# EAGLE schematic untitled_4 (EAGLE 9.2.2)
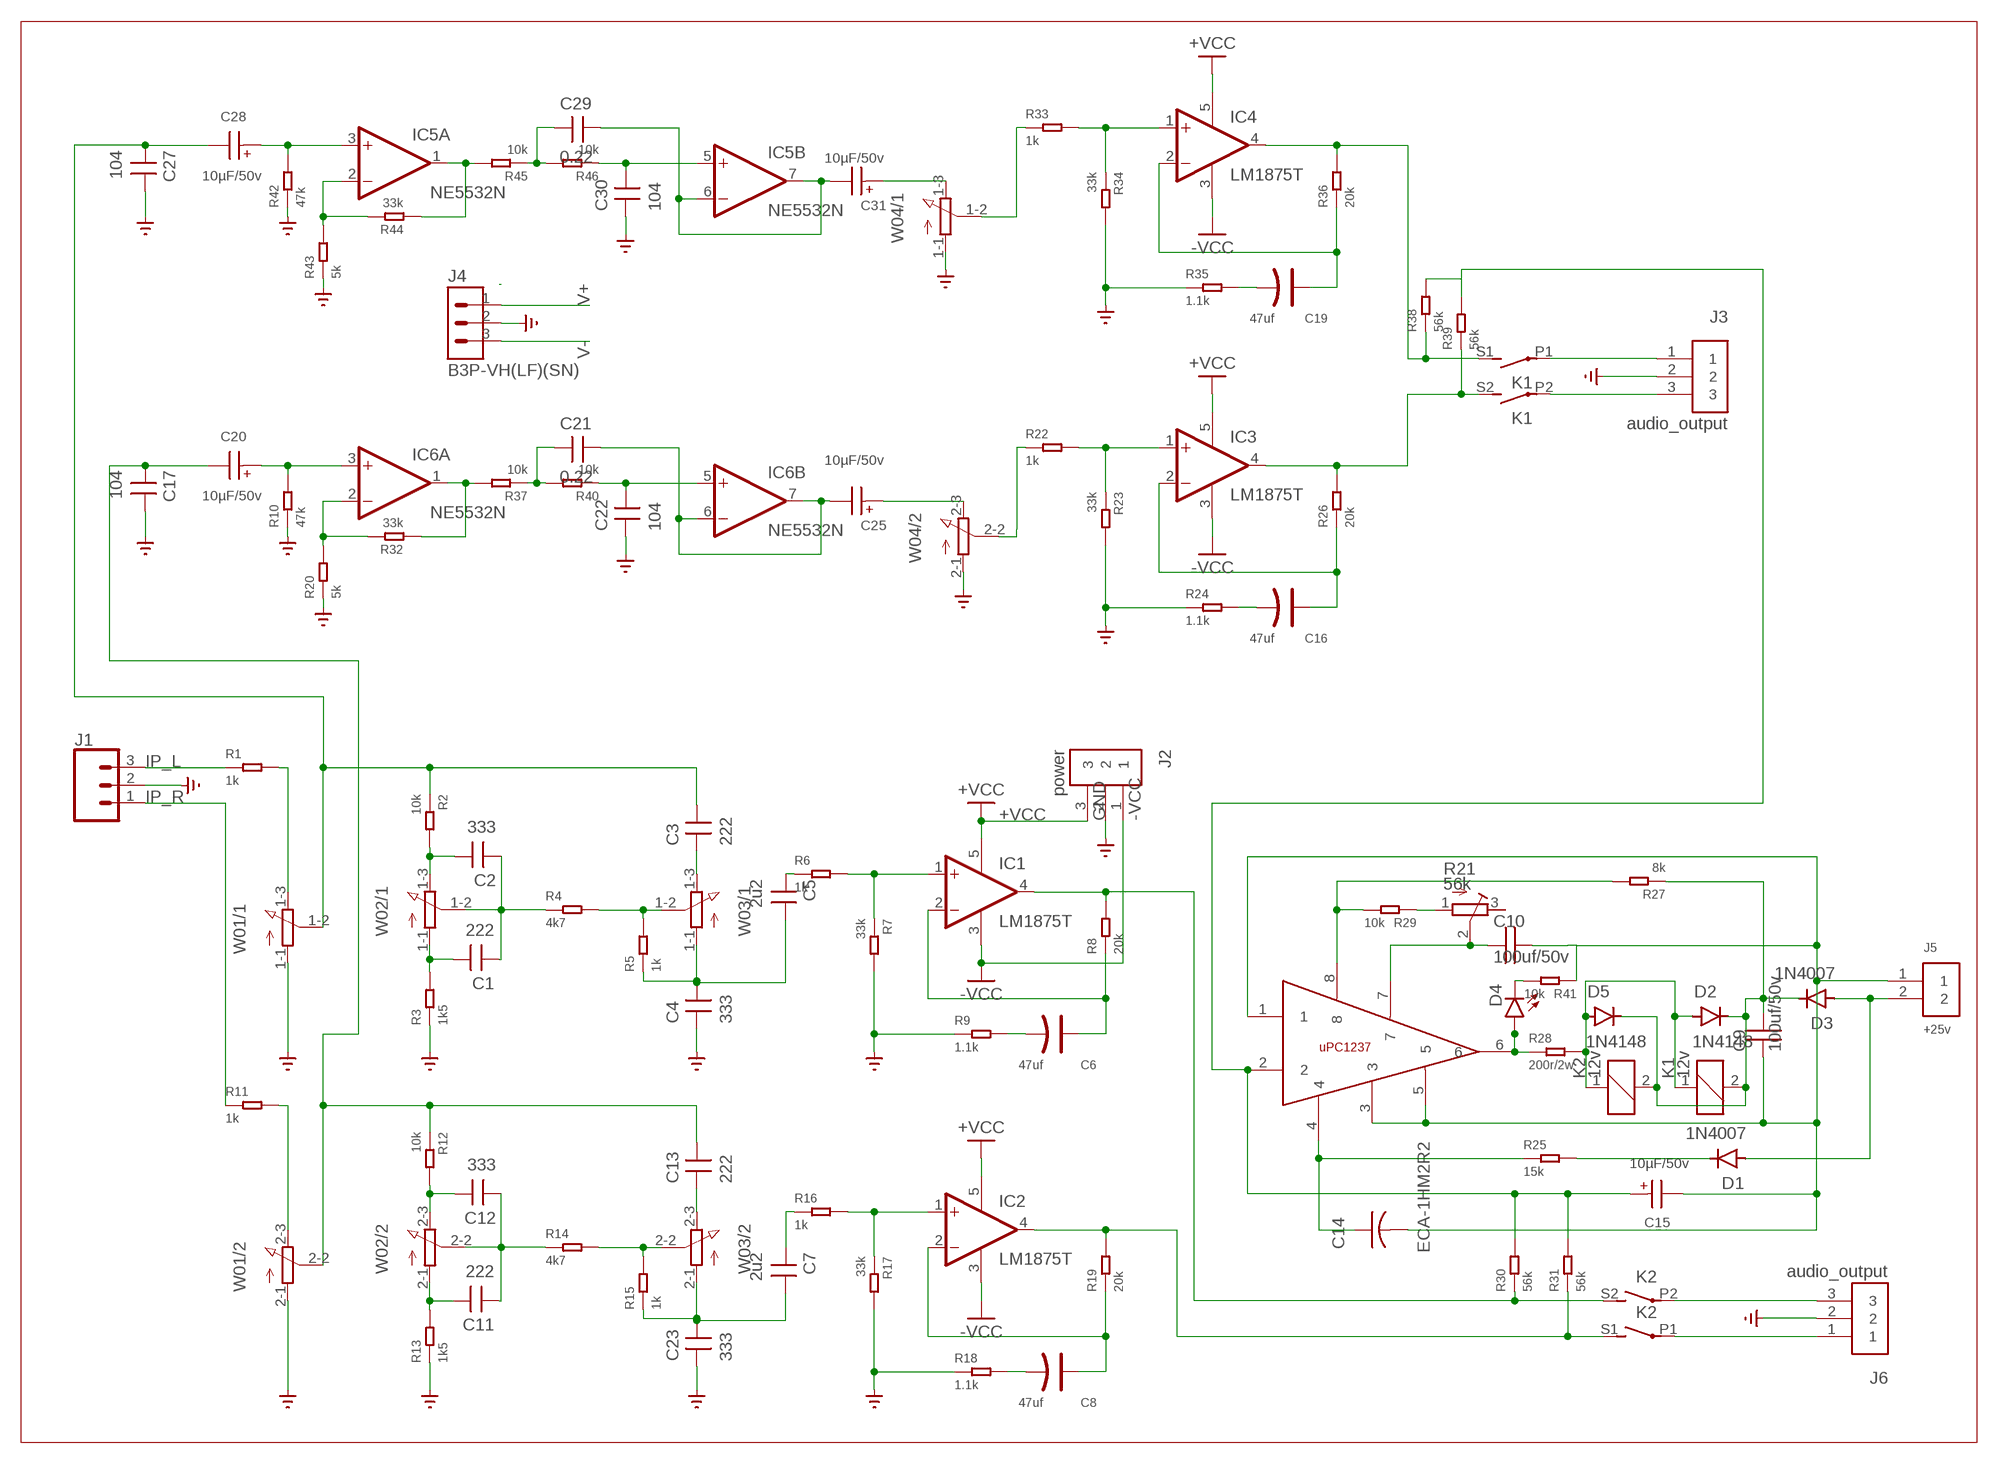
[diagram p0: schematic, sheet 1]

## Parts
C1  222  5.08MM-  [5.08MM-独石电容]
C2  333  5.08MM-  [5.08MM-独石电容]
C3  222  5.08MM-  [5.08MM-独石电容]
C4  333  5.08MM-  [5.08MM-独石电容]
C5  2u2  5.08MM-  [5.08MM-独石电容]
C6  47uf  DIP-ALUMINUM-47UF-16V(D5-H7MM)  [PC-D5.3MM]
C7  2u2  5.08MM-  [5.08MM-独石电容]
C8  47uf  DIP-ALUMINUM-47UF-16V(D5-H7MM)  [PC-D5.3MM]
C9  100uf/50v  50V100UF8X12  [8X12]
C10  100uf/50v  50V100UF8X12  [8X12]
C11  222  5.08MM-  [5.08MM-独石电容]
C12  333  5.08MM-  [5.08MM-独石电容]
C13  222  5.08MM-  [5.08MM-独石电容]
C14  ECA-1HM2R2  [CAP_RADIAL_2MM]
C15  10µF/50v  WCAP-AT1H_5X11_860240272001  [WCAP-AT1H_5X11(DXL)]
C16  47uf  DIP-ALUMINUM-47UF-16V(D5-H7MM)  [PC-D5.3MM]
C17  104  5.08MM-  [5.08MM-独石电容]
C19  47uf  DIP-ALUMINUM-47UF-16V(D5-H7MM)  [PC-D5.3MM]
C20  10µF/50v  WCAP-AT1H_5X11_860240272001  [WCAP-AT1H_5X11(DXL)]
C21  0.22  5.08MM-  [5.08MM-独石电容]
C22  104  5.08MM-  [5.08MM-独石电容]
C23  333  5.08MM-  [5.08MM-独石电容]
C25  10µF/50v  WCAP-AT1H_5X11_860240272001  [WCAP-AT1H_5X11(DXL)]
C27  104  5.08MM-  [5.08MM-独石电容]
C28  10µF/50v  WCAP-AT1H_5X11_860240272001  [WCAP-AT1H_5X11(DXL)]
C29  0.22  5.08MM-  [5.08MM-独石电容]
C30  104  5.08MM-  [5.08MM-独石电容]
C31  10µF/50v  WCAP-AT1H_5X11_860240272001  [WCAP-AT1H_5X11(DXL)]
D1  1N4007  [DO-41]
D2  1N4148  1N4007  [DO-41]
D3  1N4007  [DO-41]
D4  BEAGLEBONE_BLUE_LED-3MM-NO_SILK  [BEAGLEBONE_BLUE_BEAGLEBONE_BLUE_LED3MM-NS]
D5  1N4148  1N4007  [DO-41]
IC1  LM1875T  [CB367]
IC2  LM1875T  [CB367]
IC3  LM1875T  [CB367]
IC4  LM1875T  [CB367]
IC5  NE5532N  [DIL08]
IC6  NE5532N  [DIL08]
J1  CONN_03POLAR  [MOLEX-1X3]
J2  power  691311400103  [TERMINALBLOCK_PLUGGABLE-3-7.62MM]
J3  audio_output  691311400103  [TERMINALBLOCK_PLUGGABLE-3-7.62MM]
J4  B3P-VH(LF)(SN)  [HDR-03]
J5  +25v  S2B-PH-K-S(LF)(SN)  [S2B-PH-K-S(LF)(SN)]
J6  audio_output  691311400103  [TERMINALBLOCK_PLUGGABLE-3-7.62MM]
K1  12v  G2R2A  [G2R2A]
K2  12v  G2R2A  [G2R2A]
R1  1k  DIP-RES-1M-5%-1/4W(PR-D2.3XL6.5MM)  [PR-D2.3XL6.5MM]
R2  10k  DIP-RES-1M-5%-1/4W(PR-D2.3XL6.5MM)  [PR-D2.3XL6.5MM]
R3  1k5  DIP-RES-1M-5%-1/4W(PR-D2.3XL6.5MM)  [PR-D2.3XL6.5MM]
R4  4k7  DIP-RES-1M-5%-1/4W(PR-D2.3XL6.5MM)  [PR-D2.3XL6.5MM]
R5  1k  DIP-RES-1M-5%-1/4W(PR-D2.3XL6.5MM)  [PR-D2.3XL6.5MM]
R6  1k  DIP-RES-1M-5%-1/4W(PR-D2.3XL6.5MM)  [PR-D2.3XL6.5MM]
R7  33k  DIP-RES-1M-5%-1/4W(PR-D2.3XL6.5MM)  [PR-D2.3XL6.5MM]
R8  20k  DIP-RES-1M-5%-1/4W(PR-D2.3XL6.5MM)  [PR-D2.3XL6.5MM]
R9  1.1k  DIP-RES-1M-5%-1/4W(PR-D2.3XL6.5MM)  [PR-D2.3XL6.5MM]
R10  47k  DIP-RES-1M-5%-1/4W(PR-D2.3XL6.5MM)  [PR-D2.3XL6.5MM]
R11  1k  DIP-RES-1M-5%-1/4W(PR-D2.3XL6.5MM)  [PR-D2.3XL6.5MM]
R12  10k  DIP-RES-1M-5%-1/4W(PR-D2.3XL6.5MM)  [PR-D2.3XL6.5MM]
R13  1k5  DIP-RES-1M-5%-1/4W(PR-D2.3XL6.5MM)  [PR-D2.3XL6.5MM]
R14  4k7  DIP-RES-1M-5%-1/4W(PR-D2.3XL6.5MM)  [PR-D2.3XL6.5MM]
R15  1k  DIP-RES-1M-5%-1/4W(PR-D2.3XL6.5MM)  [PR-D2.3XL6.5MM]
R16  1k  DIP-RES-1M-5%-1/4W(PR-D2.3XL6.5MM)  [PR-D2.3XL6.5MM]
R17  33k  DIP-RES-1M-5%-1/4W(PR-D2.3XL6.5MM)  [PR-D2.3XL6.5MM]
R18  1.1k  DIP-RES-1M-5%-1/4W(PR-D2.3XL6.5MM)  [PR-D2.3XL6.5MM]
R19  20k  DIP-RES-1M-5%-1/4W(PR-D2.3XL6.5MM)  [PR-D2.3XL6.5MM]
R20  5k  DIP-RES-1M-5%-1/4W(PR-D2.3XL6.5MM)  [PR-D2.3XL6.5MM]
R21  56k  R-TRIMM3296W  [RTRIM3296W]
R22  1k  DIP-RES-1M-5%-1/4W(PR-D2.3XL6.5MM)  [PR-D2.3XL6.5MM]
R23  33k  DIP-RES-1M-5%-1/4W(PR-D2.3XL6.5MM)  [PR-D2.3XL6.5MM]
R24  1.1k  DIP-RES-1M-5%-1/4W(PR-D2.3XL6.5MM)  [PR-D2.3XL6.5MM]
R25  15k  DIP-RES-1M-5%-1/4W(PR-D2.3XL6.5MM)  [PR-D2.3XL6.5MM]
R26  20k  DIP-RES-1M-5%-1/4W(PR-D2.3XL6.5MM)  [PR-D2.3XL6.5MM]
R27  8k  DIP-RES-1M-5%-1/4W(PR-D2.3XL6.5MM)  [PR-D2.3XL6.5MM]
R28  200r/2w  DIP-RES-1M-5%-1/4W(PR-D2.3XL6.5MM)  [PR-D2.3XL6.5MM]
R29  10k  DIP-RES-1M-5%-1/4W(PR-D2.3XL6.5MM)  [PR-D2.3XL6.5MM]
R30  56k  DIP-RES-1M-5%-1/4W(PR-D2.3XL6.5MM)  [PR-D2.3XL6.5MM]
R31  56k  DIP-RES-1M-5%-1/4W(PR-D2.3XL6.5MM)  [PR-D2.3XL6.5MM]
R32  33k  DIP-RES-1M-5%-1/4W(PR-D2.3XL6.5MM)  [PR-D2.3XL6.5MM]
R33  1k  DIP-RES-1M-5%-1/4W(PR-D2.3XL6.5MM)  [PR-D2.3XL6.5MM]
R34  33k  DIP-RES-1M-5%-1/4W(PR-D2.3XL6.5MM)  [PR-D2.3XL6.5MM]
R35  1.1k  DIP-RES-1M-5%-1/4W(PR-D2.3XL6.5MM)  [PR-D2.3XL6.5MM]
R36  20k  DIP-RES-1M-5%-1/4W(PR-D2.3XL6.5MM)  [PR-D2.3XL6.5MM]
R37  10k  DIP-RES-1M-5%-1/4W(PR-D2.3XL6.5MM)  [PR-D2.3XL6.5MM]
R38  56k  DIP-RES-1M-5%-1/4W(PR-D2.3XL6.5MM)  [PR-D2.3XL6.5MM]
R39  56k  DIP-RES-1M-5%-1/4W(PR-D2.3XL6.5MM)  [PR-D2.3XL6.5MM]
R40  10k  DIP-RES-1M-5%-1/4W(PR-D2.3XL6.5MM)  [PR-D2.3XL6.5MM]
R41  10k  DIP-RES-1M-5%-1/4W(PR-D2.3XL6.5MM)  [PR-D2.3XL6.5MM]
R42  47k  DIP-RES-1M-5%-1/4W(PR-D2.3XL6.5MM)  [PR-D2.3XL6.5MM]
R43  5k  DIP-RES-1M-5%-1/4W(PR-D2.3XL6.5MM)  [PR-D2.3XL6.5MM]
R44  33k  DIP-RES-1M-5%-1/4W(PR-D2.3XL6.5MM)  [PR-D2.3XL6.5MM]
R45  10k  DIP-RES-1M-5%-1/4W(PR-D2.3XL6.5MM)  [PR-D2.3XL6.5MM]
R46  10k  DIP-RES-1M-5%-1/4W(PR-D2.3XL6.5MM)  [PR-D2.3XL6.5MM]
U2  UPC1237HA  [SIP8]
W01  3RP/1610G  [3RP/1610G]
W02  3RP/1610G  [3RP/1610G]
W03  3RP/1610G  [3RP/1610G]
W04  3RP/1610G  [3RP/1610G]

## Nets
+VCC: IC1.5(V+) IC2.5(V+) IC3.5(V+) IC4.5(V+) J2.3
-VCC: IC1.3(V-) IC2.3(V-) IC3.3(V-) IC4.3(V-) J2.1
GND: C4.P$2 C17.P$1 C22.P$2 C23.P$2 C27.P$1 C30.P$2 J1.2 J2.2 J3.2 J4.2 J6.2 R3.1 R7.2 R9.1 R10.1 R13.1 R17.2 R18.1 R20.1 R23.2 R24.1 R34.2 R35.1 R42.1 R43.1 W01.1-1(/1:A) W01.2-1(/2:A) W04.1-1(/1:A) W04.2-1(/2:A) ; supply symbol labelled SUPPLY0_GND_
IP_L: J1.3 R1.1
IP_R: J1.1 R11.1
N$1: R1.2 W01.1-3(/1:E)
N$2: D4.K(C) R41.2
N$3: C2.P$1 R2.2 W02.1-3(/1:E)
N$4: C1.P$1 R3.2 W02.1-1(/1:A)
N$5: R4.2 R5.2 W03.1-2(/1:S)
N$6: C1.P$2 C2.P$2 R4.1 W02.1-2(/1:S)
N$7: IC1.1(+IN) R6.2 R7.1
N$8: C4.P$1 C5.P$1 R5.1 W03.1-1(/1:A)
N$9: IC1.4(OUT) K2.S2(3:S) R8.2 R30.1
N$10: C6.+ IC1.2(-IN) R8.1
N$11: C5.P$2 R6.1
N$12: C6.- R9.2
N$14: C3.P$2 W03.1-3(/1:E)
N$15: R11.2 W01.2-3(/2:E)
N$16: C3.P$1 C27.P$2 C28.2(-) R2.1 W01.1-2(/1:S)
N$17: C12.P$1 R12.2 W02.2-3(/2:E)
N$18: C11.P$1 R13.2 W02.2-1(/2:A)
N$19: R14.2 R15.2 W03.2-2(/2:S)
N$20: C11.P$2 C12.P$2 R14.1 W02.2-2(/2:S)
N$21: C7.P$1 C23.P$1 R15.1 W03.2-1(/2:A)
N$22: IC2.1(+IN) R16.2 R17.1
N$23: IC2.4(OUT) K2.S1(2:S) R19.2 R31.1
N$24: C8.+ IC2.2(-IN) R19.1
N$25: C7.P$2 R16.1
N$26: C8.- R18.2
N$27: C20.1(+) IC6.3(A:+IN) R10.2
N$28: C13.P$2 W03.2-3(/2:E)
N$29: J6.1 K2.P1(2:P)
N$30: J6.3 K2.P2(3:P)
N$31: D1.C R25.2
N$32: C10.1 R21.2(S) U2.7
N$33: R33.1 W04.1-2(/1:S)
N$34: IC3.1(+IN) R22.2 R23.1
N$35: IC3.4(OUT) K1.S2(3:S) R26.2 R39.1
N$36: C16.+ IC3.2(-IN) R26.1
N$37: R22.1 W04.2-2(/2:S)
N$38: C16.- R24.2
N$39: IC6.2(A:-IN) R20.2 R32.2
N$40: D1.A D3.A J5.2
N$41: D4.A R28.1 U2.6
N$42: D2.A D5.A K1.1 K2.1 R28.2
N$43: C9.2 D2.C D3.C D5.C K1.2 K2.2 R27.1
N$44: R27.2 R29.2 U2.8
N$45: R21.1(A) R29.1
N$46: J3.3 K1.P2(3:P)
N$47: C14.1 R25.1 U2.4
N$48: C15.1(+) R30.2 R31.2 R38.2 R39.2 U2.2
N$49: C28.1(+) IC5.3(A:+IN) R42.2
N$50: IC4.1(+IN) R33.2 R34.1
N$51: IC4.4(OUT) K1.S1(2:S) R36.2 R38.1
N$52: C19.+ IC4.2(-IN) R36.1
N$54: C19.- R35.2
N$55: IC6.1(A:OUT) R32.1 R37.2
N$56: C9.1 C10.2 C14.2 C15.2(-) J5.1 R41.1 U2.1 U2.3 U2.5
N$57: J3.1 K1.P1(2:P)
N$58: C13.P$1 C17.P$2 C20.2(-) R12.1 W01.2-2(/2:S)
N$59: C21.P$2 R37.1 R40.2
N$60: C22.P$1 IC6.5(B:+IN) R40.1
N$61: C21.P$1 C25.2(-) IC6.6(B:-IN) IC6.7(B:OUT)
N$62: C29.P$1 C31.2(-) IC5.6(B:-IN) IC5.7(B:OUT)
N$63: IC5.2(A:-IN) R43.2 R44.2
N$64: IC5.1(A:OUT) R44.1 R45.2
N$65: C29.P$2 R45.1 R46.2
N$66: C30.P$1 IC5.5(B:+IN) R46.1
N$68: C31.1(+) W04.1-3(/1:E)
N$69: C25.1(+) W04.2-3(/2:E)
V+: J4.1
V-: J4.3
Unconnected: R21.3(E)

## Power pins joined to a net without a drawn wire
V+: IC5.8(P:V+) IC6.8(P:V+)
V-: IC5.4(P:V-) IC6.4(P:V-)

## Library data of the parts
C1-C5 C7 C11-C13 C17 C21-C23 C27 C29 C30 = Audio-Power-amlifier:5.08MM-; LONG: 5.08mm
C6 C8 C16 C19 = OPL_Capacitor:DIP-ALUMINUM-47UF-16V(D5-H7MM): 302030033; MPN: KS 100uF/16V; VALUE: 100uf
C9 C10 = Audio-Power-amlifier:50V100UF8X12
C14 = Resistor_Capacitor:ECA-1HM2R2: CAP ALUM 2.2UF 20% 50V RADIAL Manufacturer's datasheet <https://media.digikey.com/pdf/Data%20Sheets/Panasonic%20Electronic%20Components/ECA-xxM%20Series,TypeA.pdf>; CREATED_BY: PCBLayout.com; DIGIKEY_PART_NUMBER: P5175-ND; MANUFACTURER: Panasonic Electronic Components; MPN: ECA-1HM2R2; PACKAGE: CAP RADIAL 2MM LS
C15 C20 C25 C28 C31 = Wurth_Capacitors_WCAP-AT1H:WCAP-AT1H_5X11: WCAP-AT1H Aluminium Electrolytic Capacitors Long Life +105 °C Characteristics Long life product series Mounting style: THT Radial Capacitance range: 6.8 µF ‒ 3300 µF Capacitance tolerance: ±20 % Voltage range (UR): 10 ‒ 450 V(DC) Operating temperature: -40 °C up to +105 °C for UR ≤100 V(DC) -25 °C up to +105 °C for UR > 100 V(DC) Endurance: 5000 ‒ 10000 h @ +105 °C Dimensions (DxL) in mm: 5.0 x 11.0 up to 18.0 x 35.5 Recommended soldering: Wave soldering Applications Long life applications (industry, medical) Filtering Smoothing Energy storage Coupling e.g. Switched-mode power supply, AC/DC converter, adapter, charger, digital camera <https://www.we-online.com/catalog/media/o14727v209%20Family_WCAP-AT1H.jpg> Details see: https://www.we-online.com/catalog/en/WCAP-AT1H/ Updated by yingchun,Shan;2020-02-28 2020(C) Würth Elektronik; DATASHEET-URL: https://www.we-online.com/catalog/datasheet/860240272001.pdf; DF: 19%; DIAMETER: 5mm; I-LEAK: 4.7uA; I-RIPPLE: 100mA; L: 11mm; OPERATING-TEMPERATURE: -40 °C up to +105 °C; PART-NUMBER: 860240272001; PITCH: 2mm; TECHNICAL-REFERENCE: ATDC110470M010DSPA3E000; VALUE: 47 µF; VR: 10V(DC)
D1-D3 D5 = Diodes:1N4007: DIODE GEN PURP 1KV 1A DO41 Manufacturer's datasheet <https://www.mccsemi.com/pdf/Products/1N4001-1N4007(DO-41).pdf>; CREATED_BY: PCBLayout.com; DIGIKEY_PART_NUMBER: 1N4007MSCT-ND; MANUFACTURER: Micro Commercial Co; MPN: 1N4007; PACKAGE: DO-41
D4 = BeagleBone_Blue_R3:BEAGLEBONE_BLUE_LED: LEDs Standard schematic elements and footprints for 5mm, 3mm, 1206, and 0603 sized LEDs. 5mm - Spark Fun Electronics SKU : COM-00529 (and others)
IC1-IC4 = linear:LM1875T: Power OP AMP
IC5 IC6 = linear:NE5532: AUDIO AMPLIFIER
J1 = SparkFun-Connectors:CONN_03: Multi connection point. Often used as Generic Header-pin footprint for 0.1 inch spaced/style header connections On any of the 0.1 inch spaced packages, you can populate with these: Break Away Headers - Straight <https://www.sparkfun.com/products/116> (PRT-00116) Break Away Male Headers - Right Angle <https://www.sparkfun.com/products/553> (PRT-00553) Female Headers <https://www.sparkfun.com/products/115> (PRT-00115) Break Away Headers - Machine Pin <https://www.sparkfun.com/products/117> (PRT-00117) Break Away Female Headers - Swiss Machine Pin <https://www.sparkfun.com/products/743> (PRT-00743) Stackable Header - 3 Pin (Female, 0.1") <https://www.sparkfun.com/products/13875> (PRT-13875) For SCREWTERMINALS and SPRING TERMINALS visit here: Screw Terimnals on SparkFun.com <https://www.sparkfun.com/search/results?term=Screw+Terminals> (5mm/3.5mm/2.54mm spacing) This device is also useful as a general connection point to wire up your design to another part of your project. Our various solder wires solder well into these plated through hole pads. Hook-Up Wire - Assortment (Stranded, 22 AWG) <https://www.sparkfun.com/products/11375> (PRT-11375) Hook-Up Wire - Assortment (Solid Core, 22 AWG) <https://www.sparkfun.com/products/11367> (PRT-11367) View the entire wire category on our website here <https://www.sparkfun.com/categories/141> Special notes: Molex polarized connector foot print use with SKU : PRT-08232 with associated crimp pins and housings.; PROD_ID: CONN-08625; SF_ID: PRT-08096
J2 J3 J6 = Terminal Blocks:691311400103: 7.62MM CLOSE VERTICAL PCB HEADER WR-TBL Manufacturer's datasheet <https://katalog.we-online.com/em/datasheet/6913114001xx.pdf>; CREATED_BY: PCBLayout.com; DIGIKEY_PART_NO: 732-2824-ND; MANUFACTURER: WURTH ELEKTRONIK; MPN: 691311400103
J4 = Connectors:B3P-VH(LF)(SN): CONN HEADER VERT 3POS 3.96MM Manufacturer's datasheet <http://www.jst-mfg.com/product/pdf/eng/eVH.pdf>; CREATED_BY: PCBLayout.com; DIGIKEY_PART_NUMBER: 455-1640-ND; MANUFACTURER: JST Sales America Inc.; MPN: B3P-VH(LF)(SN)
J5 = Connectors:S2B-PH-K-S(LF)(SN): CONN HEADER R/A 2POS 2MM Manufacturer's datasheet <http://www.jst-mfg.com/product/pdf/eng/ePH.pdf>; CREATED_BY: PCBLayout.com; DIGI_KEY_PART_NUMBER: 455-1719-ND; MANUFACTURER: JST Sales America Inc.; MPN: S2B-PH-K-S(LF)(SN)
K1 K2 = relay:G2R2A: RELAY 2 x norm. open, Omron; MPN: G2R-2A-DC24; OC_FARNELL: 6985269; OC_NEWARK: 36M5257
R1-R20 R22-R46 = OPL_Resistor:DIP-RES-1M-5%-1/4W(PR-D2.3XL6.5MM): 301020005; MPN: FHCFR-1/4W-105J; VALUE: 1M
R21 = rcl:R-TRIMM: Trimm resistor; SPICEMODEL: X; SPICEPREFIXL: POT
U2 = Audio-Power-amlifier:UPC1237HA
W01-W04 = pot:3RP/1610G: 16mm Potentiometer two level Source: http://www.alphapotentiometers.net/html/16mm_pot_2.html